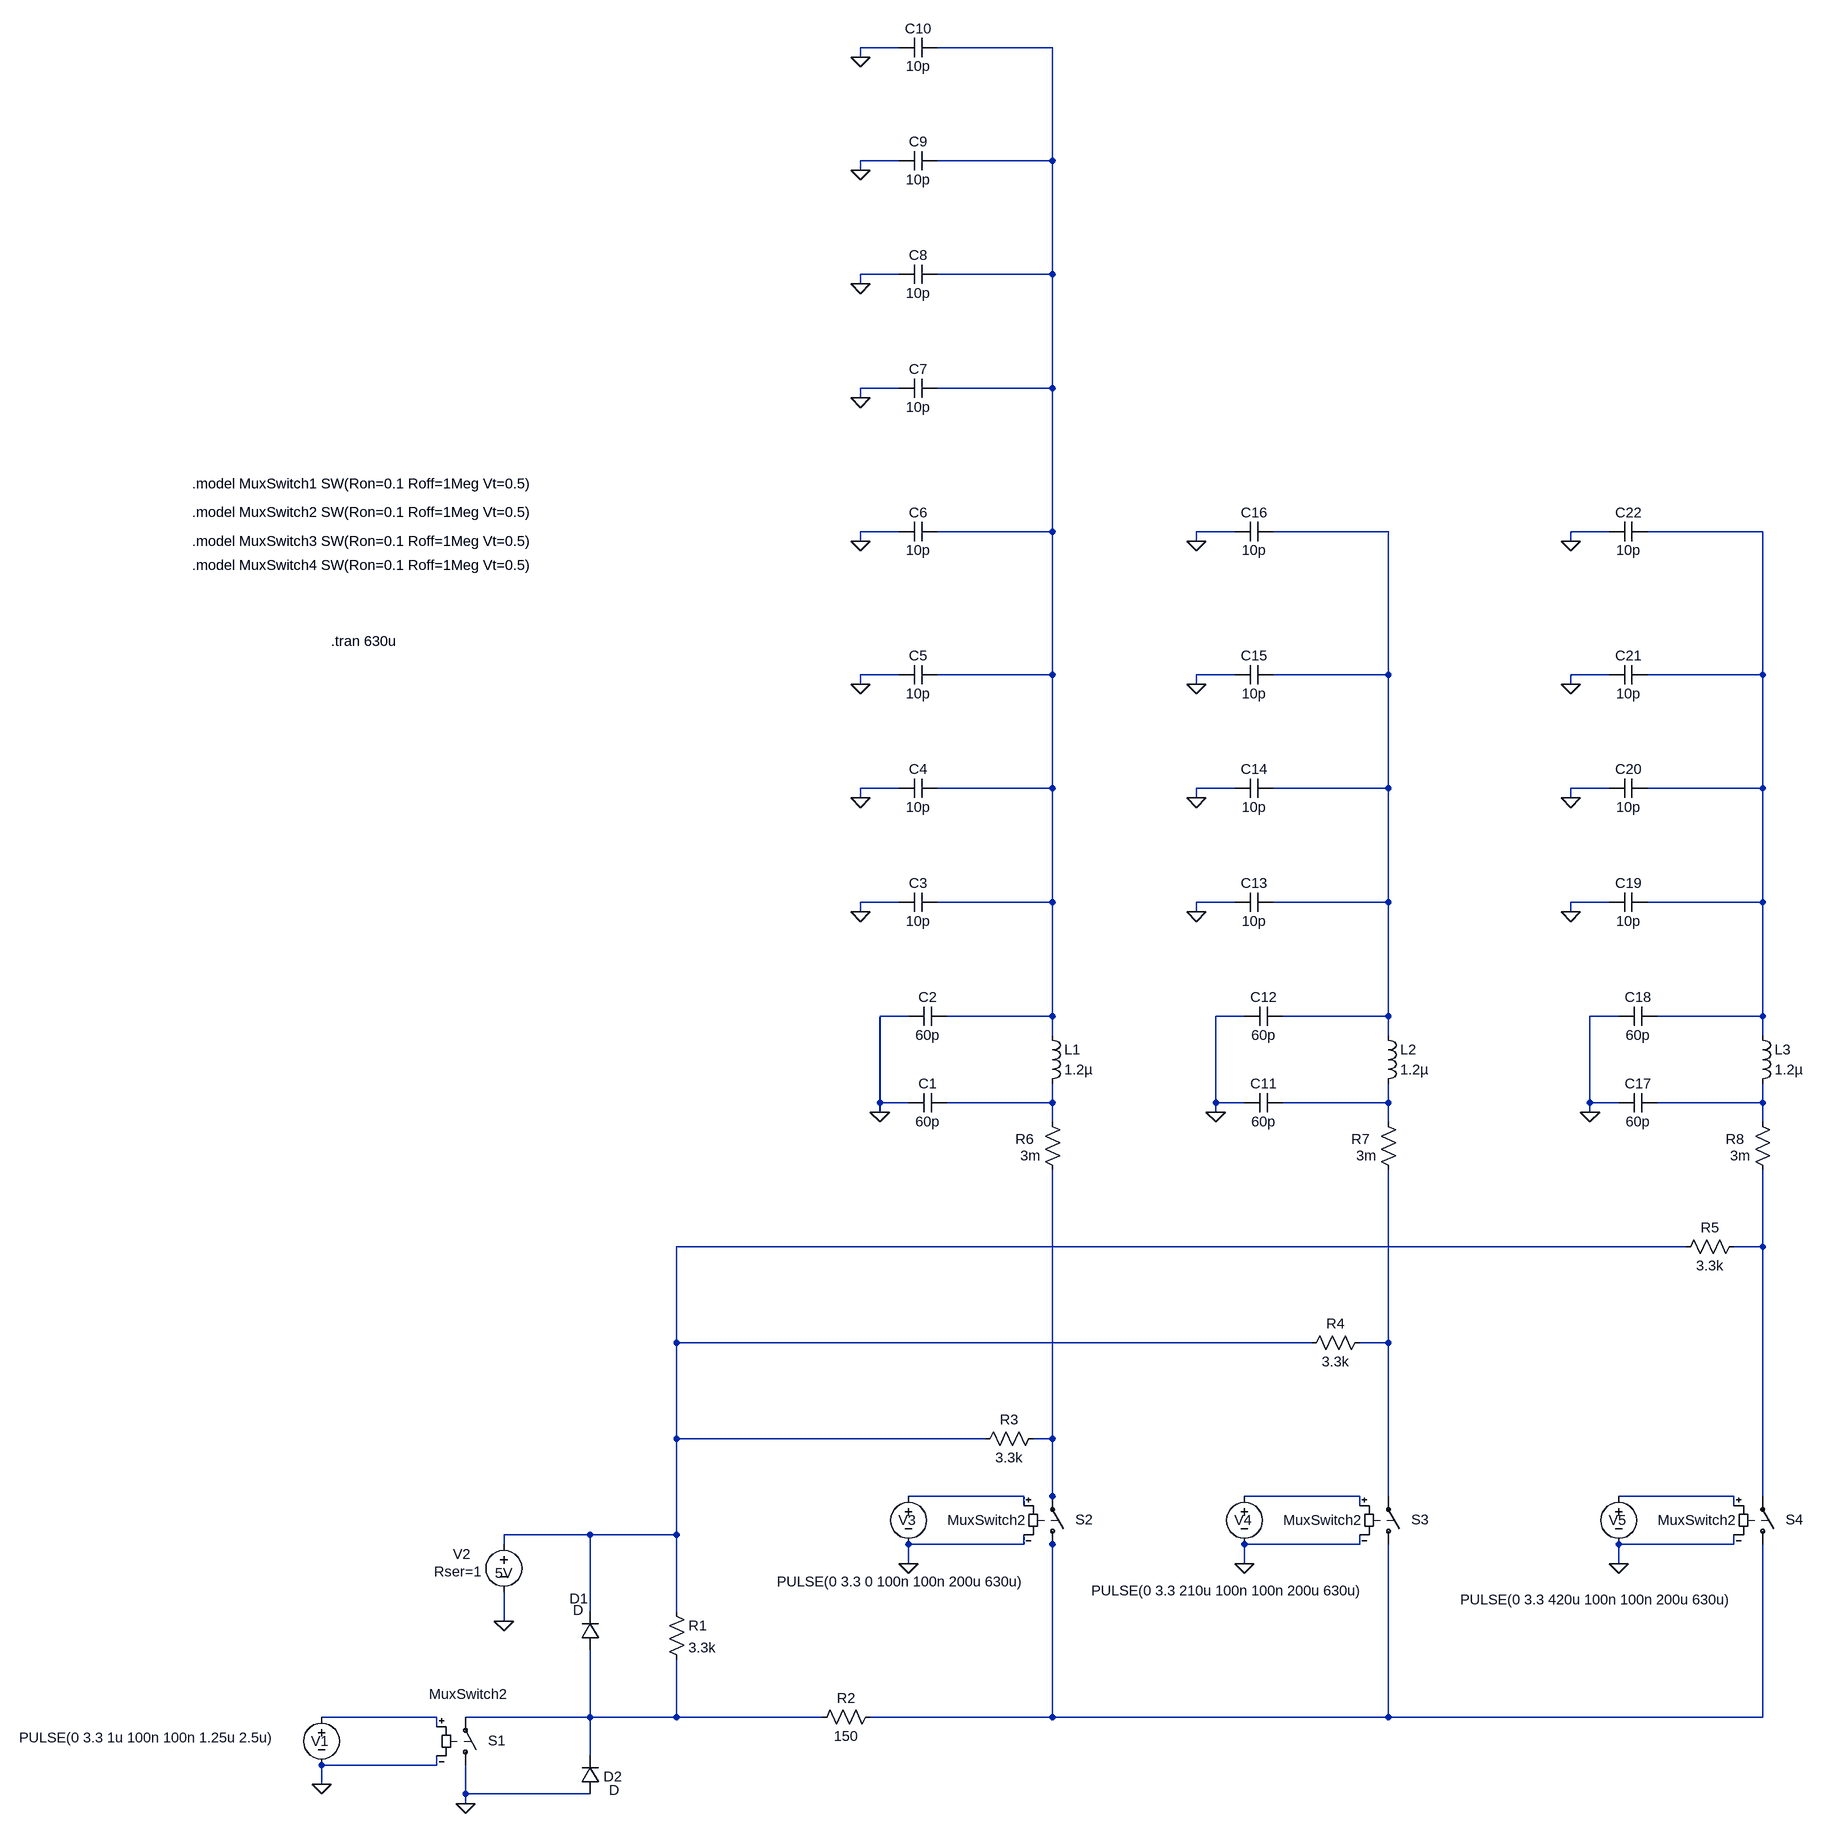
[diagram p0: schematic I2C_Bus_Simulation.asc]
I2C_Bus_Simulation.asc, the LTspice schematic file:
Version 4.1
SHEET 1 2204 1744
WIRE -384 -1952 -448 -1952
WIRE -128 -1952 -320 -1952
WIRE -448 -1936 -448 -1952
WIRE -384 -1680 -448 -1680
WIRE -128 -1680 -128 -1952
WIRE -128 -1680 -320 -1680
WIRE -448 -1664 -448 -1680
WIRE -384 -1424 -448 -1424
WIRE -128 -1424 -128 -1680
WIRE -128 -1424 -320 -1424
WIRE -448 -1408 -448 -1424
WIRE -384 -1184 -448 -1184
WIRE -128 -1184 -128 -1424
WIRE -128 -1184 -320 -1184
WIRE -448 -1168 -448 -1184
WIRE -384 -912 -448 -912
WIRE -128 -912 -128 -1184
WIRE -128 -912 -320 -912
WIRE 176 -912 112 -912
WIRE 432 -912 240 -912
WIRE 800 -912 736 -912
WIRE 1056 -912 864 -912
WIRE -448 -896 -448 -912
WIRE 112 -896 112 -912
WIRE 736 -896 736 -912
WIRE -384 -640 -448 -640
WIRE -128 -640 -128 -912
WIRE -128 -640 -320 -640
WIRE 176 -640 112 -640
WIRE 432 -640 432 -912
WIRE 432 -640 240 -640
WIRE 800 -640 736 -640
WIRE 1056 -640 1056 -912
WIRE 1056 -640 864 -640
WIRE -448 -624 -448 -640
WIRE 112 -624 112 -640
WIRE 736 -624 736 -640
WIRE -384 -384 -448 -384
WIRE -128 -384 -128 -640
WIRE -128 -384 -320 -384
WIRE 176 -384 112 -384
WIRE 432 -384 432 -640
WIRE 432 -384 240 -384
WIRE 800 -384 736 -384
WIRE 1056 -384 1056 -640
WIRE 1056 -384 864 -384
WIRE -448 -368 -448 -384
WIRE 112 -368 112 -384
WIRE 736 -368 736 -384
WIRE -384 -144 -448 -144
WIRE -128 -144 -128 -384
WIRE -128 -144 -320 -144
WIRE 176 -144 112 -144
WIRE 432 -144 432 -384
WIRE 432 -144 240 -144
WIRE 800 -144 736 -144
WIRE 1056 -144 1056 -384
WIRE 1056 -144 864 -144
WIRE -448 -128 -448 -144
WIRE 112 -128 112 -144
WIRE 736 -128 736 -144
WIRE -368 96 -416 96
WIRE -128 96 -128 -144
WIRE -128 96 -304 96
WIRE 192 96 144 96
WIRE 432 96 432 -144
WIRE 432 96 256 96
WIRE 816 96 768 96
WIRE 1056 96 1056 -144
WIRE 1056 96 880 96
WIRE -128 128 -128 96
WIRE 432 128 432 96
WIRE 1056 128 1056 96
WIRE -416 240 -416 96
WIRE -368 240 -416 240
WIRE -128 240 -128 208
WIRE -128 240 -304 240
WIRE 144 240 144 96
WIRE 192 240 144 240
WIRE 432 240 432 208
WIRE 432 240 256 240
WIRE 768 240 768 96
WIRE 816 240 768 240
WIRE 1056 240 1056 208
WIRE 1056 240 880 240
WIRE -416 256 -416 240
WIRE 144 256 144 240
WIRE 768 256 768 240
WIRE -128 272 -128 240
WIRE 432 272 432 240
WIRE 1056 272 1056 240
WIRE 928 480 -768 480
WIRE 1056 480 1056 352
WIRE 1056 480 1008 480
WIRE -768 640 -768 480
WIRE 304 640 -768 640
WIRE 432 640 432 352
WIRE 432 640 384 640
WIRE -768 800 -768 640
WIRE -240 800 -768 800
WIRE -128 800 -128 352
WIRE -128 800 -160 800
WIRE -176 896 -368 896
WIRE -128 896 -128 800
WIRE 384 896 192 896
WIRE 432 896 432 640
WIRE 1008 896 816 896
WIRE 1056 896 1056 480
WIRE -176 912 -176 896
WIRE -128 912 -128 896
WIRE 384 912 384 896
WIRE 1008 912 1008 896
WIRE -912 960 -1056 960
WIRE -768 960 -768 800
WIRE -768 960 -912 960
WIRE -1056 976 -1056 960
WIRE -176 976 -176 960
WIRE -176 976 -368 976
WIRE -128 976 -128 960
WIRE 384 976 384 960
WIRE 384 976 192 976
WIRE 1008 976 1008 960
WIRE 1008 976 816 976
WIRE -368 1008 -368 976
WIRE 192 1008 192 976
WIRE 816 1008 816 976
WIRE -912 1088 -912 960
WIRE -768 1088 -768 960
WIRE -1056 1104 -1056 1056
WIRE -1168 1264 -1360 1264
WIRE -912 1264 -912 1152
WIRE -912 1264 -1120 1264
WIRE -768 1264 -768 1168
WIRE -768 1264 -912 1264
WIRE -512 1264 -768 1264
WIRE -128 1264 -128 976
WIRE -128 1264 -432 1264
WIRE 432 1264 432 976
WIRE 432 1264 -128 1264
WIRE 1056 1264 1056 976
WIRE 1056 1264 432 1264
WIRE -1168 1280 -1168 1264
WIRE -912 1328 -912 1264
WIRE -1168 1344 -1168 1328
WIRE -1168 1344 -1360 1344
WIRE -1360 1376 -1360 1344
WIRE -1120 1392 -1120 1344
WIRE -912 1392 -1120 1392
WIRE -1120 1408 -1120 1392
FLAG -1056 1104 0
FLAG -368 1008 0
FLAG -1360 1376 0
FLAG -1120 1408 0
FLAG -448 -128 0
FLAG -448 -368 0
FLAG -448 -624 0
FLAG -448 -896 0
FLAG -416 256 0
FLAG -448 -1168 0
FLAG -448 -1408 0
FLAG -448 -1664 0
FLAG -448 -1936 0
FLAG 192 1008 0
FLAG 816 1008 0
FLAG 112 -128 0
FLAG 112 -368 0
FLAG 112 -624 0
FLAG 112 -896 0
FLAG 144 256 0
FLAG 736 -128 0
FLAG 736 -368 0
FLAG 736 -624 0
FLAG 736 -896 0
FLAG 768 256 0
SYMBOL voltage -1056 960 R0
WINDOW 0 -70 48 Bottom 2
WINDOW 3 0 49 Top 2
WINDOW 123 0 0 Left 0
WINDOW 39 -77 77 Bottom 2
SYMATTR InstName V2
SYMATTR Value 5V
SYMATTR SpiceLine Rser=1
SYMBOL res -784 1072 R0
SYMATTR InstName R1
SYMATTR Value 3.3k
SYMBOL res -416 1248 R90
WINDOW 0 0 56 VBottom 2
WINDOW 3 32 56 VTop 2
SYMATTR InstName R2
SYMATTR Value 150
SYMBOL res -112 368 R180
WINDOW 0 47 67 Left 2
WINDOW 3 36 40 Left 2
SYMATTR InstName R6
SYMATTR Value 3m
SYMBOL ind -144 112 R0
WINDOW 3 36 73 Left 2
SYMATTR Value 1.2µ
SYMATTR InstName L1
SYMBOL sw -128 992 M180
WINDOW 0 38 57 Left 2
WINDOW 3 -175 56 Left 2
SYMATTR InstName S2
SYMATTR Value MuxSwitch2
SYMBOL voltage -368 880 R0
WINDOW 0 -17 56 Left 2
WINDOW 3 -219 158 Left 2
WINDOW 123 0 0 Left 0
WINDOW 39 0 0 Left 0
SYMATTR InstName V3
SYMATTR Value PULSE(0 3.3 0 100n 100n 200u 630u)
SYMBOL sw -1120 1360 M180
WINDOW 0 38 57 Left 2
WINDOW 3 -61 134 Left 2
SYMATTR InstName S1
SYMATTR Value MuxSwitch2
SYMBOL voltage -1360 1248 R0
WINDOW 0 -17 56 Left 2
WINDOW 3 -504 50 Left 2
WINDOW 123 0 0 Left 0
WINDOW 39 0 0 Left 0
SYMATTR InstName V1
SYMATTR Value PULSE(0 3.3 1u 100n 100n 1.25u 2.5u)
SYMBOL cap -320 -160 R90
WINDOW 0 0 32 VBottom 2
WINDOW 3 32 32 VTop 2
SYMATTR InstName C3
SYMATTR Value 10p
SYMBOL cap -320 -400 R90
WINDOW 0 0 32 VBottom 2
WINDOW 3 32 32 VTop 2
SYMATTR InstName C4
SYMATTR Value 10p
SYMBOL cap -320 -656 R90
WINDOW 0 0 32 VBottom 2
WINDOW 3 32 32 VTop 2
SYMATTR InstName C5
SYMATTR Value 10p
SYMBOL cap -320 -928 R90
WINDOW 0 0 32 VBottom 2
WINDOW 3 32 32 VTop 2
SYMATTR InstName C6
SYMATTR Value 10p
SYMBOL cap -304 224 R90
WINDOW 0 0 32 VBottom 2
WINDOW 3 32 32 VTop 2
SYMATTR InstName C1
SYMATTR Value 60p
SYMBOL cap -304 80 R90
WINDOW 0 0 32 VBottom 2
WINDOW 3 32 32 VTop 2
SYMATTR InstName C2
SYMATTR Value 60p
SYMBOL cap -320 -1200 R90
WINDOW 0 0 32 VBottom 2
WINDOW 3 32 32 VTop 2
SYMATTR InstName C7
SYMATTR Value 10p
SYMBOL cap -320 -1440 R90
WINDOW 0 0 32 VBottom 2
WINDOW 3 32 32 VTop 2
SYMATTR InstName C8
SYMATTR Value 10p
SYMBOL cap -320 -1696 R90
WINDOW 0 0 32 VBottom 2
WINDOW 3 32 32 VTop 2
SYMATTR InstName C9
SYMATTR Value 10p
SYMBOL cap -320 -1968 R90
WINDOW 0 0 32 VBottom 2
WINDOW 3 32 32 VTop 2
SYMATTR InstName C10
SYMATTR Value 10p
SYMBOL sw 432 992 M180
WINDOW 0 38 57 Left 2
WINDOW 3 -175 56 Left 2
SYMATTR InstName S3
SYMATTR Value MuxSwitch2
SYMBOL voltage 192 880 R0
WINDOW 0 -17 56 Left 2
WINDOW 3 -255 173 Left 2
WINDOW 123 0 0 Left 0
WINDOW 39 0 0 Left 0
SYMATTR InstName V4
SYMATTR Value PULSE(0 3.3 210u 100n 100n 200u 630u)
SYMBOL sw 1056 992 M180
WINDOW 0 38 57 Left 2
WINDOW 3 -175 56 Left 2
SYMATTR InstName S4
SYMATTR Value MuxSwitch2
SYMBOL voltage 816 880 R0
WINDOW 0 -17 56 Left 2
WINDOW 3 -264 188 Left 2
WINDOW 123 0 0 Left 0
WINDOW 39 0 0 Left 0
SYMATTR InstName V5
SYMATTR Value PULSE(0 3.3 420u 100n 100n 200u 630u)
SYMBOL diode -896 1152 R180
WINDOW 0 20 85 Left 2
WINDOW 3 27 66 Left 2
SYMATTR InstName D1
SYMBOL diode -896 1392 R180
WINDOW 0 -37 29 Left 2
WINDOW 3 -33 6 Left 2
SYMATTR InstName D2
SYMBOL res 448 368 R180
WINDOW 0 47 67 Left 2
WINDOW 3 36 40 Left 2
SYMATTR InstName R7
SYMATTR Value 3m
SYMBOL ind 416 112 R0
WINDOW 3 36 73 Left 2
SYMATTR Value 1.2µ
SYMATTR InstName L2
SYMBOL cap 240 -160 R90
WINDOW 0 0 32 VBottom 2
WINDOW 3 32 32 VTop 2
SYMATTR InstName C13
SYMATTR Value 10p
SYMBOL cap 240 -400 R90
WINDOW 0 0 32 VBottom 2
WINDOW 3 32 32 VTop 2
SYMATTR InstName C14
SYMATTR Value 10p
SYMBOL cap 240 -656 R90
WINDOW 0 0 32 VBottom 2
WINDOW 3 32 32 VTop 2
SYMATTR InstName C15
SYMATTR Value 10p
SYMBOL cap 240 -928 R90
WINDOW 0 0 32 VBottom 2
WINDOW 3 32 32 VTop 2
SYMATTR InstName C16
SYMATTR Value 10p
SYMBOL cap 256 224 R90
WINDOW 0 0 32 VBottom 2
WINDOW 3 32 32 VTop 2
SYMATTR InstName C11
SYMATTR Value 60p
SYMBOL cap 256 80 R90
WINDOW 0 0 32 VBottom 2
WINDOW 3 32 32 VTop 2
SYMATTR InstName C12
SYMATTR Value 60p
SYMBOL res 1072 368 R180
WINDOW 0 47 67 Left 2
WINDOW 3 36 40 Left 2
SYMATTR InstName R8
SYMATTR Value 3m
SYMBOL ind 1040 112 R0
WINDOW 3 36 73 Left 2
SYMATTR Value 1.2µ
SYMATTR InstName L3
SYMBOL cap 864 -160 R90
WINDOW 0 0 32 VBottom 2
WINDOW 3 32 32 VTop 2
SYMATTR InstName C19
SYMATTR Value 10p
SYMBOL cap 864 -400 R90
WINDOW 0 0 32 VBottom 2
WINDOW 3 32 32 VTop 2
SYMATTR InstName C20
SYMATTR Value 10p
SYMBOL cap 864 -656 R90
WINDOW 0 0 32 VBottom 2
WINDOW 3 32 32 VTop 2
SYMATTR InstName C21
SYMATTR Value 10p
SYMBOL cap 864 -928 R90
WINDOW 0 0 32 VBottom 2
WINDOW 3 32 32 VTop 2
SYMATTR InstName C22
SYMATTR Value 10p
SYMBOL cap 880 224 R90
WINDOW 0 0 32 VBottom 2
WINDOW 3 32 32 VTop 2
SYMATTR InstName C17
SYMATTR Value 60p
SYMBOL cap 880 80 R90
WINDOW 0 0 32 VBottom 2
WINDOW 3 32 32 VTop 2
SYMATTR InstName C18
SYMATTR Value 60p
SYMBOL res -144 784 R90
WINDOW 0 0 56 VBottom 2
WINDOW 3 32 56 VTop 2
SYMATTR InstName R3
SYMATTR Value 3.3k
SYMBOL res 400 624 R90
WINDOW 0 0 56 VBottom 2
WINDOW 3 32 56 VTop 2
SYMATTR InstName R4
SYMATTR Value 3.3k
SYMBOL res 1024 464 R90
WINDOW 0 0 56 VBottom 2
WINDOW 3 32 56 VTop 2
SYMATTR InstName R5
SYMATTR Value 3.3k
TEXT -1576 -992 Left 2 !.model MuxSwitch1 SW(Ron=0.1 Roff=1Meg Vt=0.5)
TEXT -1576 -944 Left 2 !.model MuxSwitch2 SW(Ron=0.1 Roff=1Meg Vt=0.5)
TEXT -1576 -896 Left 2 !.model MuxSwitch3 SW(Ron=0.1 Roff=1Meg Vt=0.5)
TEXT -1576 -856 Left 2 !.model MuxSwitch4 SW(Ron=0.1 Roff=1Meg Vt=0.5)
TEXT -1344 -696 Left 2 !.tran 630u

The netlist it stands for:
* I2C_Bus_Simulation.asc
V2 N007 0 5V Rser=1
R1 N007 N016 3.3k
R2 N014 N016 150
R6 N010 N004 3m
L1 N001 N004 1.2µ
S2 N014 N010 N011 0 MuxSwitch2
V3 N011 0 PULSE(0 3.3 0 100n 100n 200u 630u)
S1 0 N016 N015 0 MuxSwitch2
V1 N015 0 PULSE(0 3.3 1u 100n 100n 1.25u 2.5u)
C3 N001 0 10p
C4 N001 0 10p
C5 N001 0 10p
C6 N001 0 10p
C1 N004 0 60p
C2 N001 0 60p
C7 N001 0 10p
C8 N001 0 10p
C9 N001 0 10p
C10 N001 0 10p
S3 N014 N009 N012 0 MuxSwitch2
V4 N012 0 PULSE(0 3.3 210u 100n 100n 200u 630u)
S4 N014 N008 N013 0 MuxSwitch2
V5 N013 0 PULSE(0 3.3 420u 100n 100n 200u 630u)
D1 N016 N007 D
D2 0 N016 D
R7 N009 N005 3m
L2 N002 N005 1.2µ
C13 N002 0 10p
C14 N002 0 10p
C15 N002 0 10p
C16 N002 0 10p
C11 N005 0 60p
C12 N002 0 60p
R8 N008 N006 3m
L3 N003 N006 1.2µ
C19 N003 0 10p
C20 N003 0 10p
C21 N003 0 10p
C22 N003 0 10p
C17 N006 0 60p
C18 N003 0 60p
R3 N010 N007 3.3k
R4 N009 N007 3.3k
R5 N008 N007 3.3k
.model D D
.lib standard.dio
.model MuxSwitch1 SW(Ron=0.1 Roff=1Meg Vt=0.5)
.model MuxSwitch2 SW(Ron=0.1 Roff=1Meg Vt=0.5)
.model MuxSwitch3 SW(Ron=0.1 Roff=1Meg Vt=0.5)
.model MuxSwitch4 SW(Ron=0.1 Roff=1Meg Vt=0.5)
.tran 630u
.backanno
.end